# Altium schematic sheet KA1249F51.SchDoc
size 297 x 209 mm; Firstchange: первичное применение; Typescheme: Э3; Order: 5; Address5: Дополнительное поле; Date: 1.1.2020; ApprovedBy: Хажиев А.Ф.; Author: Хажиев А.Ф.; CompanyName: HAFElectronics; Address1: Импульсный источник питания; Address2: Вторая строка; Address3: Impulse Power source; Address4: Схема электрическая принципиальная; SheetNumber: 1; SheetTotal: 1; Developed: Хажиев А.Ф.; DocumentCode: XXX 1.000.000 Э3
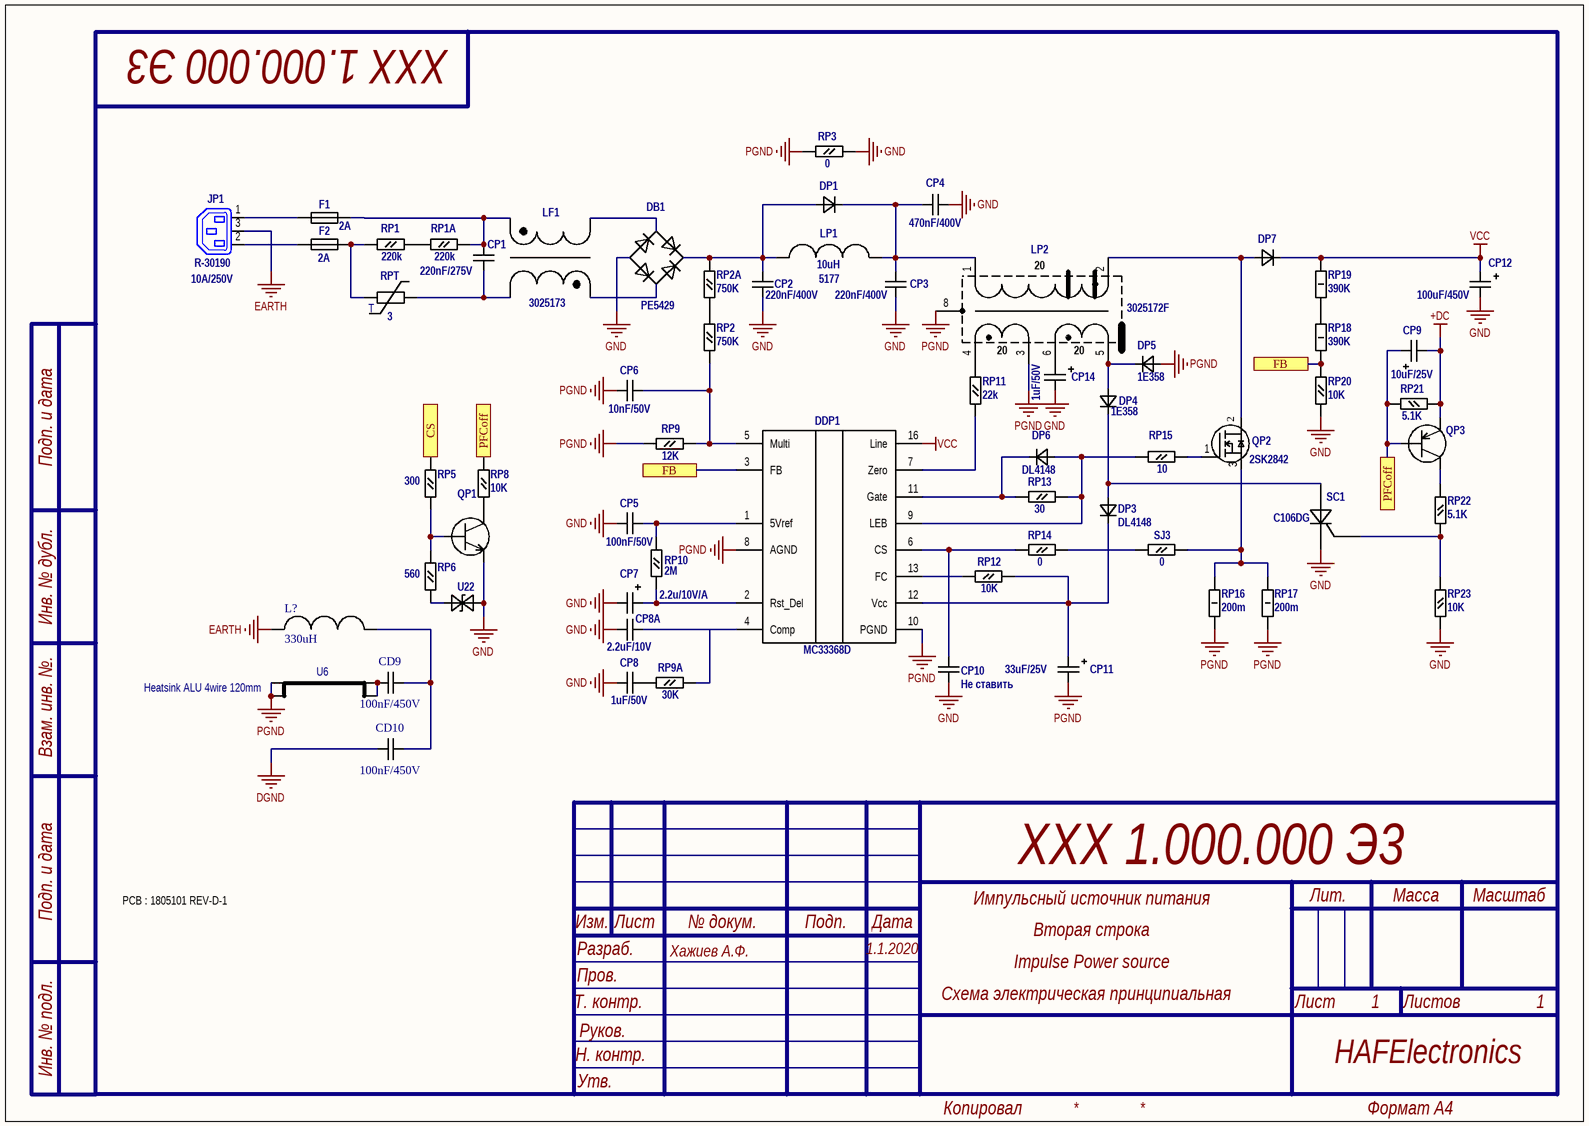
[diagram p0: KA1249F51.SchDoc]

## Parts
CD9  value 100nF/450V  [440LD22-R]  (hidden comment: 440LD22-R)
CD10  value 100nF/450V  [440LD22-R]  (hidden comment: 440LD22-R)
CP1  value 220nF/275V  [B32522C1]  (hidden comment: MPX40/100/21)
CP2  value 220nF/400V  [B32522C1]
CP3  value 220nF/400V  (hidden comment: 2.2uF/100V)
CP4  value 470nF/400V  (hidden comment: 2.2uF/100V)
CP5  value 100nF/50V  [1206 (3216)]  (hidden comment: Cap_Keram_Lead)
CP6  value 10nF/50V  [1206 (3216)]  (hidden comment: Cap_Keram_Lead)
CP7  value 2.2u/10V/A  [A (3216)]  (hidden comment: Cap_Tantal)
CP8  value 1uF/50V  [1206 (3216)]  (hidden comment: Cap_Keram_Lead)
CP8A  value 2.2uF/10V  [1206 (3216)]  (hidden comment: Cap_Keram_Lead)
CP9  value 10uF/25V  [Cap_electrolit]  (hidden comment: Cap_Electrolit_Lead)
CP10  value Не ставить  [1206 (3216)]  (hidden comment: Cap_Keram_Lead)
CP11  value 33uF/25V  [Cap_electrolit]  (hidden comment: Cap_Electrolit_Lead)
CP12  value 100uF/450V  [Cap_electrolit]  (hidden comment: Cap_Electrolit_Lead)
CP14  value 1uF/50V  [Cap_electrolit]  (hidden comment: Cap_Electrolit_Lead)
DB1  PE5429  [DB155S]
DDP1  MC33368D
DP1  FR207  [FR207]  (value not drawn)
DP3  DL4148  [SOD80]
DP4  1E358  [DO-41]
DP5  1E358  [DO-41]
DP6  DL4148  [FR207]
DP7  FR207  [FR207]  (value not drawn)
F1  Current: 2A  (hidden comment: Fuse)
F2  Current: 2A  (hidden comment: Fuse)
JP1  R-30190  value 10A/250V  [IEC7-2H3]
L?  value 330uH  [EPCOS B82464]  (hidden comment: B82464G4334M000)
LF1  3025173
LP1  5177  value 10uH  [IHTH 0750]
LP2  3025172F  w2: 20
QP1  NPN  [SOT23_BEC]  (value not drawn)
QP2  2SK2842  [TO-220AB]
QP3  PNP  [SOT23_BEC]  (value not drawn)
RP1  value 220k  [0805(2012)U]  (hidden comment: 1/8W)
RP1A  value 220k  [0805(2012)U]  (hidden comment: 1/8W)
RP2  value 750K  [1206 (3216)R]  (hidden comment: 1/8W)
RP2A  value 750K  [1206 (3216)R]  (hidden comment: 1/8W)
RP3  value 0  [0.125W]  (hidden comment: 1/8W)
RP5  value 300  [1206 (3216)R]  (hidden comment: 1/8W)
RP6  value 560  [1206 (3216)R]  (hidden comment: 1/8W)
RP8  value 10K  [1206 (3216)R]  (hidden comment: 1/8W)
RP9  value 12K  [1206 (3216)R]  (hidden comment: 1/8W)
RP9A  value 30K  [1206 (3216)R]  (hidden comment: 1/8W)
RP10  value 2M  [1206 (3216)R]  (hidden comment: 1/8W)
RP11  value 22k  [0.125W]  (hidden comment: 1/8W)
RP12  value 10K  [0.125W]  (hidden comment: 1/8W)
RP13  value 30  [0.125W]  (hidden comment: 1/8W)
RP14  value 0  [0.125W]  (hidden comment: 1/8W)
RP15  value 10  [0.125W]  (hidden comment: 1/8W)
RP16  value 200m  [C2-33H-1]  (hidden comment: C2-33-2-**)
RP17  value 200m  [C2-33H-1]  (hidden comment: C2-33-2-**)
RP18  value 390K  [C2-33H-1]  (hidden comment: C2-33-2-**)
RP19  value 390K  [C2-33H-1]  (hidden comment: C2-33-2-**)
RP20  value 10K  [1206 (3216)R]  (hidden comment: 1/8W)
RP21  value 5.1K  [1206 (3216)R]  (hidden comment: 1/8W)
RP22  value 5.1K  [1206 (3216)R]  (hidden comment: 1/8W)
RP23  value 10K  [1206 (3216)R]  (hidden comment: 1/8W)
RPT  value 3  (hidden comment: Varistor T)
SC1  C106DG  [TO-126]
SJ3  value 0  [0.125W]  (hidden comment: 1/8W)
U6  Heatsink ALU 4wire 120mm
U22  (no value)  [DO-15]

## Ports
CS, FB, PFCoff

## Nets
+DC: CP9.2(-) QP3.E RP21.2
DGND: CD10.1
EARTH: JP1.3(E) L?.1
GND: CP2.1 CP3.1 CP4.1 CP5.1 CP7.2(-) CP8.2 CP8A.2 CP10.1 CP12.2(-) CP14.2(-) DB1.4 QP1.E RP3.1 RP20.2 RP23.2 SC1.2 U22.1(A)
PGND: CP6.1 CP11.2(-) DDP1.8(AGND) DDP1.10(PGND) DP5.2(A) LP2.3 LP2.8 RP3.2 RP9.1 RP16.1 RP17.1 U6.1 U6.2
VCC: CP12.1(+) DDP1.16(Line) DP7.1(K) RP19.2
CS: RP5.1 ; port CS
FB: DDP1.3(FB) RP18.1 RP20.1 ; port FB
PFCoff: CP9.1(+) QP3.B RP8.1 RP21.1 ; port PFCoff
NetCD9_1: CD9.1 U6.3 U6.4
NetCD9_2: CD9.2 CD10.2 L?.2
NetCP1_1: CP1.1 LF1.1 RPT.1
NetCP1_2: CP1.2 F1.2 LF1.2 RP1A.1
NetCP2_2: CP2.2 DB1.3 DP1.2(A) LP1.1 RP2A.2
NetCP3_2: CP3.2 CP4.2 DP1.1(K) LP1.2 LP2.1
NetCP5_2: CP5.2 DDP1.1(5Vref) RP10.2
NetCP6_2: CP6.2 DDP1.5(Multi) RP2.2 RP9.2
NetCP7_1: CP7.1(+) DDP1.2(Rst_Del) RP10.1
NetCP8_1: CP8.1 RP9A.1
NetCP8A_1: CP8A.1 DDP1.4(Comp) RP9A.2
NetCP10_2: CP10.2 DDP1.6(CS) RP14.2
NetCP11_1: CP11.1(+) DDP1.12(Vcc) DP3.1(K) RP12.2
NetCP14_1: CP14.1(+) LP2.6
NetDB1_1: DB1.1 LF1.1
NetDB1_2: DB1.2 LF1.2
NetDDP1_7: DDP1.7(Zero) RP11.2
NetDDP1_9: DDP1.9(LEB) DP6.2(A) RP13.2 RP15.2
NetDDP1_11: DDP1.11(Gate) DP6.1(K) RP13.1
NetDDP1_13: DDP1.13(FC) RP12.1
NetDP3_2: DP3.2(A) DP4.1(K) SC1.1
NetDP4_2: DP4.2(A) DP5.1(K) LP2.5
NetDP7_2: DP7.2(A) LP2.2 QP2.2(D)
NetF1_1: F1.1 JP1.1(L)
NetF2_1: F2.1 JP1.2(N)
NetF2_2: F2.2 RP1.2 RPT.2
NetLP2_4: LP2.4 RP11.1
NetQP1_B: QP1.B RP5.2 RP6.1
NetQP1_C: QP1.C RP8.2
NetQP2_1: QP2.1(G) RP15.1
NetQP2_3: QP2.3(S) RP16.2 RP17.2 SJ3.1
NetQP3_C: QP3.C RP22.2
NetRP1_1: RP1.1 RP1A.2
NetRP2_1: RP2.1 RP2A.1
NetRP6_2: RP6.2 U22.2(K)
NetRP14_1: RP14.1 SJ3.2
NetRP18_2: RP18.2 RP19.1
NetRP22_1: RP22.1 RP23.1 SC1.3

## Notes on the sheet
- PCB : 1805101 REV-D-1
- Подп. и дата
- Инв. № дубл.
- Взам. инв. №.
- Изм.
- Разраб.
- Лист
- № докум.
- Подп.
- Дата
- Лит.
- Масса
- Масштаб
- Пров.
- Т. контр.
- Листов
- Инв. № подл.
- Утв.
- Руков.
- Н. контр.
- Копировал
- Формат А4
- (in symbol Varistor T) T

## Library data of the parts
CP1 CP2 = B32522C1225J000: 2.2uF/100V
CP3 CP4 = B32522C1225J000
DB1 = DB155S
DP3 = DL4148: Urev.max: 75V; Imax: 150mA
DP4 DP5 = 1N4002
DP6 = FR207
JP1 = Plug AC Female: IEC Mains Power Outlet, EN60 320-2-2 F Class I, PC Flange Rear Mount, Chassis Socket; PackageDocument: ver.80, 15-Sep-2003; MaximumRating: 10A, 250V a.c. (UL & CSA 15A, 250V a.c.); MountingFixtures: Not drawn on schematic symbol.; PCB_Layout: Complies with manufacturer's recommendation.; DrillSize: Corresponds to nominal value.; Published: 15-Jul-2004; LatestRevisionDate: 15-Jul-2004; LatestRevisionNote: Component Replaced & renamed from "Phonejack".; DatasheetDocument: ver.80, 15-Sep-2003; PackageReference: PX0675/PC; Publisher: Altium Limited; Terminations: P.C. Spills; ComponentLink1Description: Manufacturer Link; ComponentLink1URL: http://www.bulgin.co.uk/
LF1 = Dr_diff
LP1 = IHTH 0750 JZ EB 100 M 5A
LP2 = PFC L: w1: 20; w3: 20
QP1 = NPN: NPN General-purpose Transistor
QP2 = IRF840
RP16-RP19 = 1W
SC1 = Тринистор_К
U6 = Heatsink AULT1: 0: 0
U22 = 1.5KE__CA: VALUE: *